# EAGLE design embedded-gw (EAGLE 9.6.2)
AUTHOR: Neal Jackson; REV: A; TITLE: Embedded GW

## Sheet 1 of 3
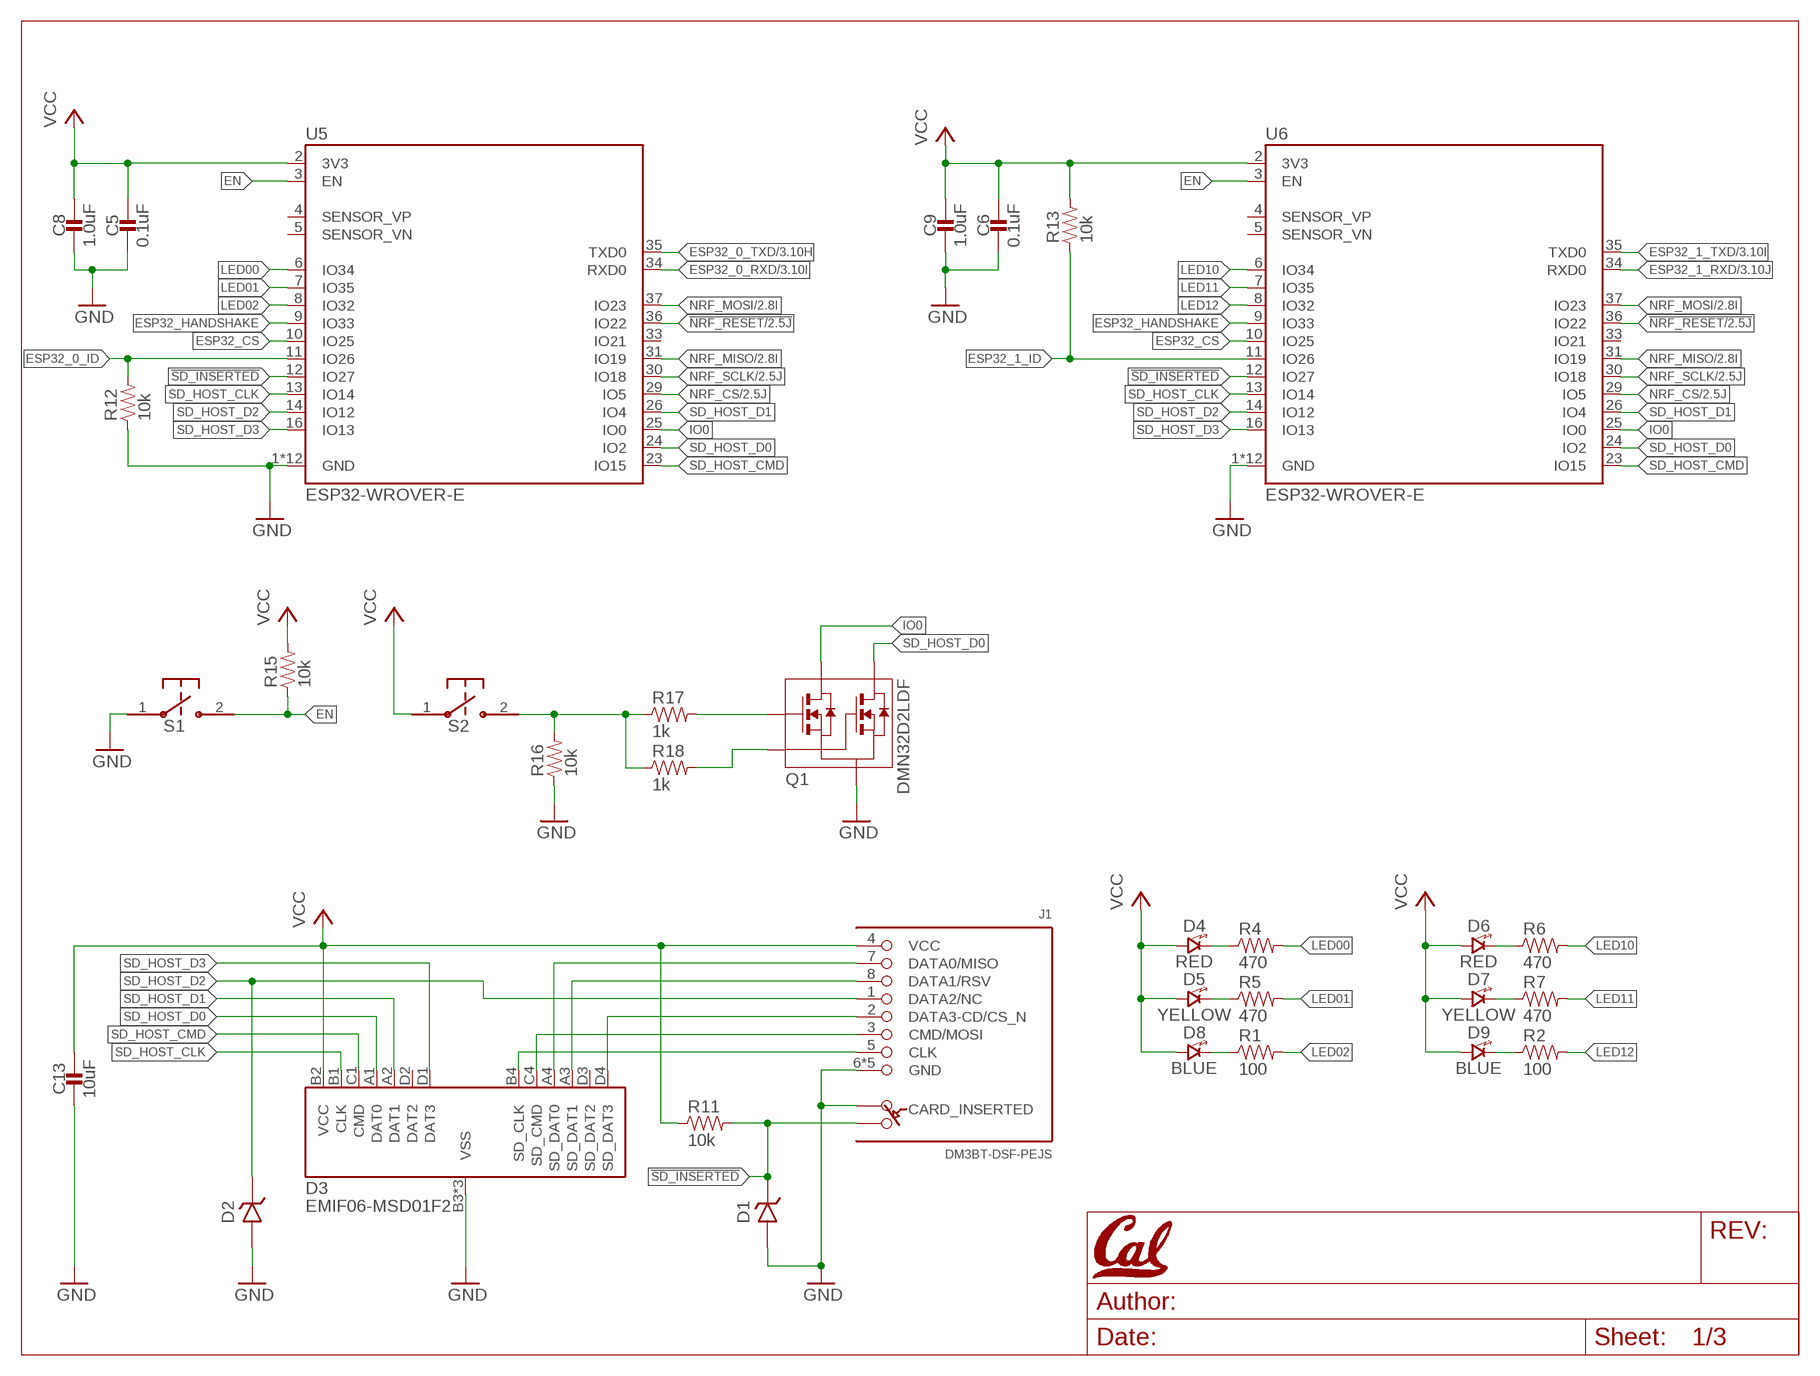
[diagram p0: schematic, sheet 1]
U$1 (LETTER_L_CAL): HEIGHT: 8.5in; WIDTH: 11in

### Parts
C5  0.1uF  CAPACITOR0402_CAP  [0402_CAP]
C6  0.1uF  CAPACITOR0402_CAP  [0402_CAP]
C8  1.0uF  CAPACITOR0402_CAP  [0402_CAP]
C9  1.0uF  CAPACITOR0402_CAP  [0402_CAP]
C13  10uF  CAPACITOR0805_CAP  [0805_CAP]
D1  DIODE_ZENER0201  [0201_DIODE]
D2  DIODE_ZENER0201  [0201_DIODE]
D3  EMIF06-MSD01F2  [BGA16C50P4X4_192X192X65N]
D4  RED  LED0603  [LED-0603]
D5  YELLOW  LED0603  [LED-0603]
D6  RED  LED0603  [LED-0603]
D7  YELLOW  LED0603  [LED-0603]
D8  BLUE  LED0603  [LED-0603]
D9  BLUE  LED0603  [LED-0603]
J1  DM3BT-DSF-PEJS  [HRS_DM3BT-DSF-PEJS]
Q1  DMN32D2LDF  [SOT353]
R1  100  RESISTOR0402_RES  [0402_RES]
R2  100  RESISTOR0402_RES  [0402_RES]
R4  470  RESISTOR0402_RES  [0402_RES]
R5  470  RESISTOR0402_RES  [0402_RES]
R6  470  RESISTOR0402_RES  [0402_RES]
R7  470  RESISTOR0402_RES  [0402_RES]
R11  10k  RESISTOR0402_RES  [0402_RES]
R12  10k  RESISTOR0402_RES  [0402_RES]
R13  10k  RESISTOR0402_RES  [0402_RES]
R15  10k  RESISTOR0402_RES  [0402_RES]
R16  10k  RESISTOR0402_RES  [0402_RES]
R17  1k  RESISTOR0402_RES  [0402_RES]
R18  1k  RESISTOR0402_RES  [0402_RES]
S1  B3U-1000P  [B3U-1000P]
S2  B3U-1000P  [B3U-1000P]
U5  ESP32-WROVER-E  [ESP32-WROVER-E]
U6  ESP32-WROVER-E  [ESP32-WROVER-E]

### Nets
!NRF_RESET: U5.36(IO22) U6.36(IO22) ; also sheet 2
!SD_INSERTED: D1.P$1(CATHODE) J1.SW-B(B) R11.2 U5.12(IO27) U6.12(IO27)
EN: R15.1 S1.2 U5.3(EN) U6.3(EN)
ESP32_0_ID: R12.2 U5.11(IO26)
ESP32_0_RXD: U5.34(RXD0) ; also sheet 3
ESP32_0_TXD: U5.35(TXD0) ; also sheet 3
ESP32_1_ID: R13.1 U6.11(IO26)
ESP32_1_RXD: U6.34(RXD0) ; also sheet 3
ESP32_1_TXD: U6.35(TXD0) ; also sheet 3
ESP32_CS: U5.10(IO25) U6.10(IO25)
ESP32_HANDSHAKE: U5.9(IO33) U6.9(IO33)
GND: C5.2 C6.2 C8.2 C9.2 C13.P$2 D1.P$2(ANODE) D2.P$2(ANODE) D3.B3(VSS) D3.C2(VSS) D3.C3(VSS) J1.6(GND) J1.S1(GND) J1.S2(GND) J1.S3(GND) J1.S4(GND) J1.SW-A(A) Q1.S R12.1 R16.1 S1.1 U5.1(GND) U5.15(GND) U5.38(GND) U5.GND1(GND) U5.GND2(GND) U5.GND3(GND) U5.GND4(GND) U5.GND5(GND) U5.GND6(GND) U5.GND7(GND) U5.GND8(GND) U5.GND9(GND) U6.1(GND) U6.15(GND) U6.38(GND) U6.GND1(GND) U6.GND2(GND) U6.GND3(GND) U6.GND4(GND) U6.GND5(GND) U6.GND6(GND) U6.GND7(GND) U6.GND8(GND) U6.GND9(GND) ; also sheet 2,3
IO0: Q1.D1 U5.25(IO0) U6.25(IO0)
LED00: R4.2 U5.6(IO34)
LED01: R5.2 U5.7(IO35)
LED02: R1.2 U5.8(IO32)
LED10: R6.2 U6.6(IO34)
LED11: R7.2 U6.7(IO35)
LED12: R2.2 U6.8(IO32)
N$1: Q1.G1 R17.2
N$4: Q1.G2 R18.2
N$5: R16.2 R17.1 R18.1 S2.2
N$6: D3.C4(SD_CMD) J1.3(CMD/MOSI)
N$8: D3.A4(SD_DAT0) J1.7(DATA0/MISO)
N$9: D3.A3(SD_DAT1) J1.8(DATA1/RSV)
N$11: D3.D4(SD_DAT3) J1.2(DATA3-CD/CS_N)
N$12: D4.C(CATHODE) R4.1
N$13: D3.B4(SD_CLK) J1.5(CLK)
N$14: D5.C(CATHODE) R5.1
N$15: D8.C(CATHODE) R1.1
N$19: D6.C(CATHODE) R6.1
N$20: D7.C(CATHODE) R7.1
N$21: D9.C(CATHODE) R2.1
NRF_CS: U5.29(IO5) U6.29(IO5) ; also sheet 2
NRF_MISO: U5.31(IO19) U6.31(IO19) ; also sheet 2
NRF_MOSI: U5.37(IO23) U6.37(IO23) ; also sheet 2
NRF_SCLK: U5.30(IO18) U6.30(IO18) ; also sheet 2
SD_HOST_CLK: D3.B1(CLK) U5.13(IO14) U6.13(IO14)
SD_HOST_CMD: D3.C1(CMD) U5.23(IO15) U6.23(IO15)
SD_HOST_D0: D3.A1(DAT0) Q1.D2 U5.24(IO2) U6.24(IO2)
SD_HOST_D1: D3.A2(DAT1) U5.26(IO4) U6.26(IO4)
SD_HOST_D2: D2.P$1(CATHODE) J1.1(DATA2/NC) U5.14(IO12) U6.14(IO12)
SD_HOST_D3: D3.D1(DAT3) U5.16(IO13) U6.16(IO13)
VCC: C5.1 C6.1 C8.1 C9.1 C13.P$1 D3.B2(VCC) D4.A(ANODE) D5.A(ANODE) D6.A(ANODE) D7.A(ANODE) D8.A(ANODE) D9.A(ANODE) J1.4(VCC) R11.1 R13.2 R15.2 S2.1 U5.2(3V3) U6.2(3V3) ; also sheet 2,3
Unconnected: D3.D2(DAT2) D3.D3(SD_DAT2) U5.4(SENSOR_VP) U5.5(SENSOR_VN) U5.33(IO21) U6.4(SENSOR_VP) U6.5(SENSOR_VN) U6.33(IO21)

## Sheet 2 of 3
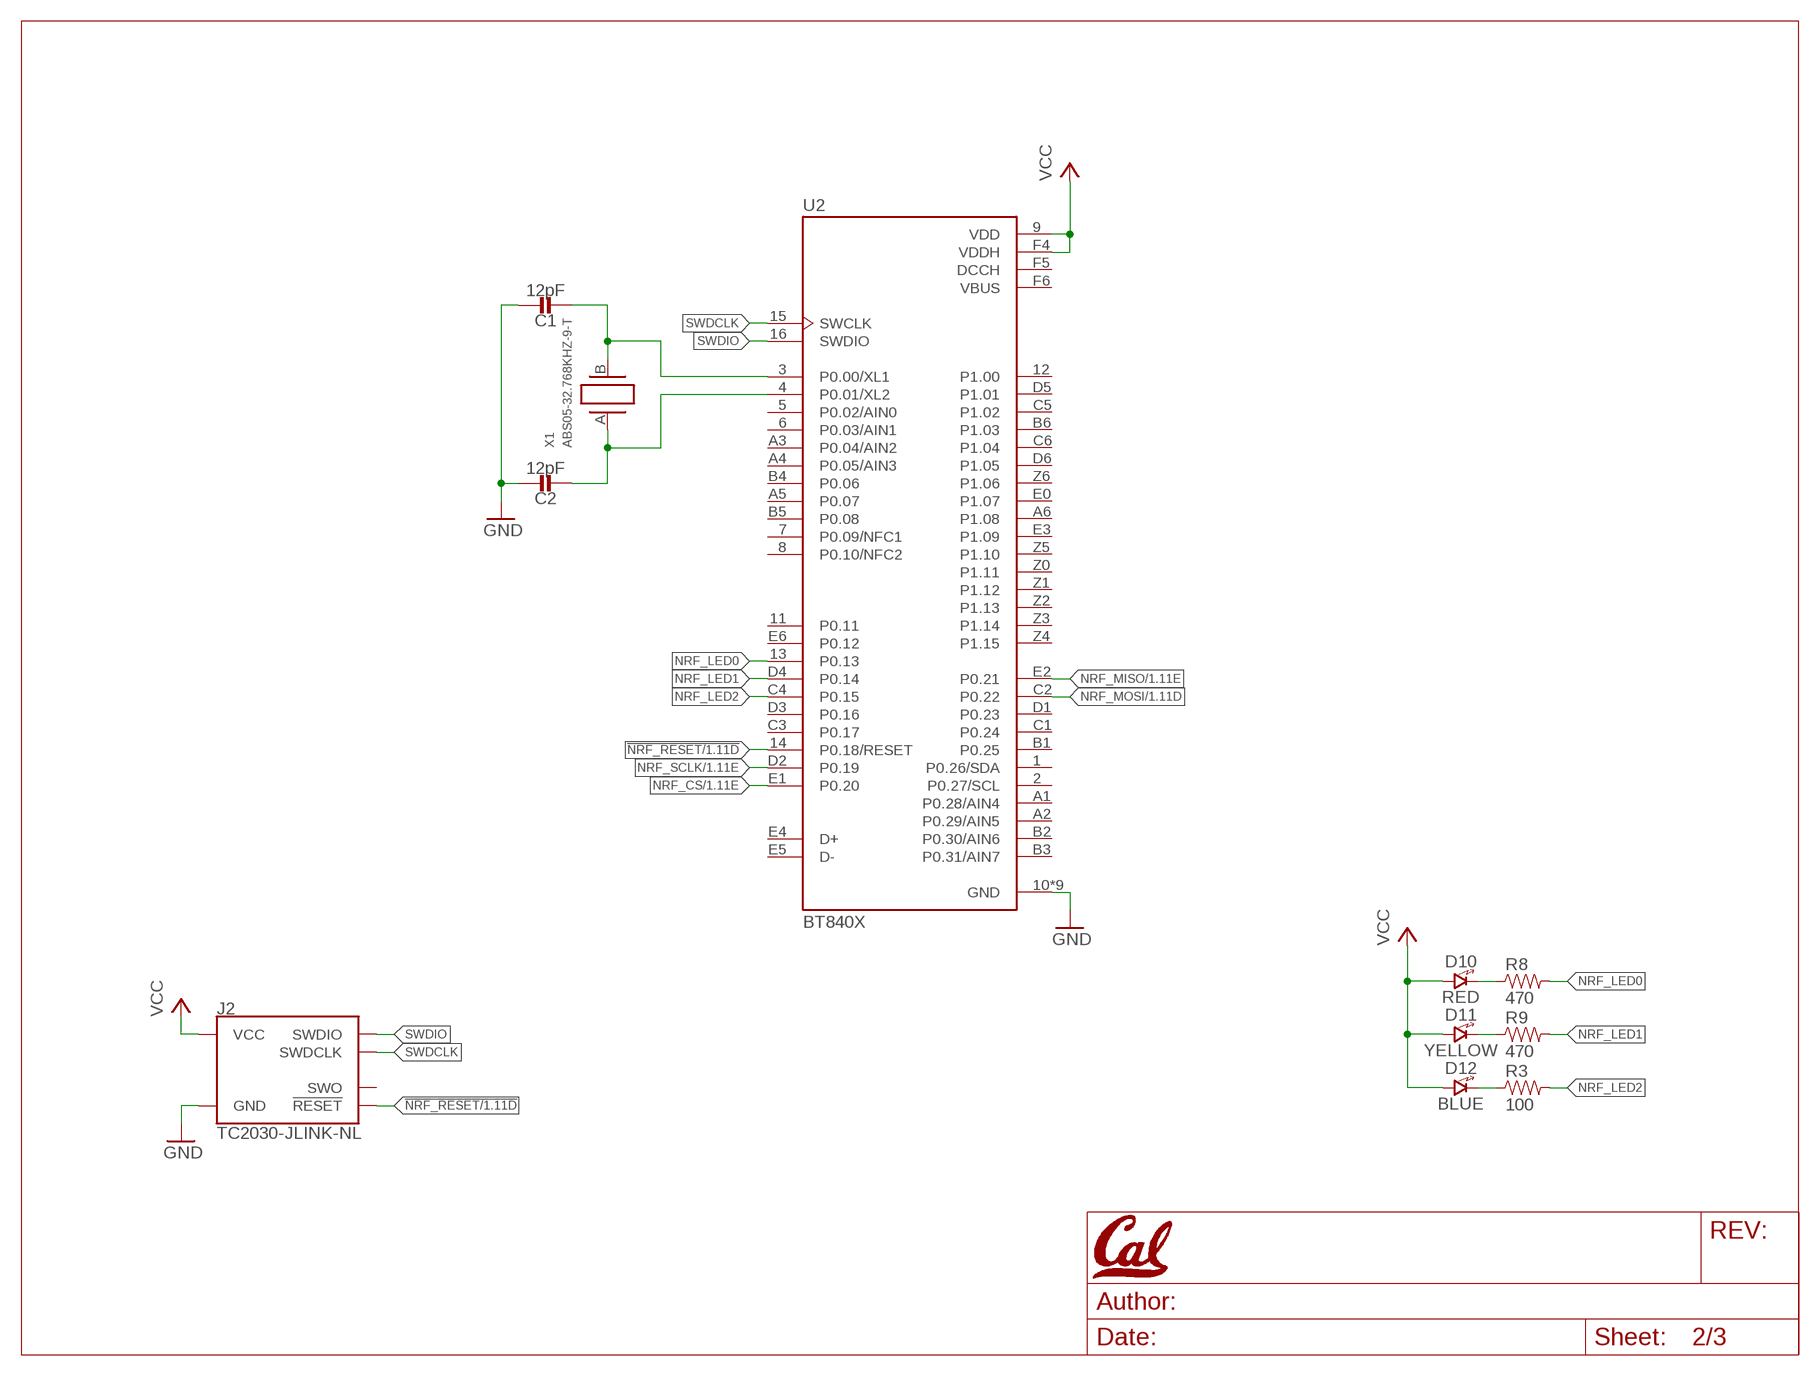
[diagram p1: schematic, sheet 2]
U$2 (LETTER_L_CAL): HEIGHT: 8.5in; WIDTH: 11in

### Parts
C1  12pF  CAPACITOR0402_CAP  [0402_CAP]
C2  12pF  CAPACITOR0402_CAP  [0402_CAP]
D10  RED  LED0603  [LED-0603]
D11  YELLOW  LED0603  [LED-0603]
D12  BLUE  LED0603  [LED-0603]
J2  TC2030-JLINK-NL  [TC2030-IDC-NL]
R3  100  RESISTOR0402_RES  [0402_RES]
R8  470  RESISTOR0402_RES  [0402_RES]
R9  470  RESISTOR0402_RES  [0402_RES]
U2  BT840X  [XCVR_BT840X]
X1  ABS05-32.768KHZ-9-T  [ABS05]

### Nets
!NRF_RESET: J2.3(!RESET) U2.14(P0.18/RESET) ; also sheet 1
GND: C1.1 C2.1 J2.5(GND) U2.10(GND) U2.A0(GND) U2.B0(GND) U2.C0(GND) U2.D0(GND) U2.F0(GND) U2.F1(GND) U2.F2(GND) U2.F3(GND) ; also sheet 1,3
N$2: C1.2 U2.3(P0.00/XL1) X1.B
N$3: C2.2 U2.4(P0.01/XL2) X1.A
N$22: D10.C(CATHODE) R8.1
N$23: D11.C(CATHODE) R9.1
N$24: D12.C(CATHODE) R3.1
NC: U2.F6(VBUS)
NRF_CS: U2.E1(P0.20) ; also sheet 1
NRF_LED0: R8.2 U2.13(P0.13)
NRF_LED1: R9.2 U2.D4(P0.14)
NRF_LED2: R3.2 U2.C4(P0.15)
NRF_MISO: U2.E2(P0.21) ; also sheet 1
NRF_MOSI: U2.C2(P0.22) ; also sheet 1
NRF_SCLK: U2.D2(P0.19) ; also sheet 1
SWDCLK: J2.4(SWDCLK) U2.15(SWCLK)
SWDIO: J2.2(SWDIO) U2.16(SWDIO)
VCC: D10.A(ANODE) D11.A(ANODE) D12.A(ANODE) J2.1(VCC) U2.9(VDD) U2.F4(VDDH) ; also sheet 1,3
Unconnected: J2.6(SWO) U2.1(P0.26/SDA) U2.2(P0.27/SCL) U2.5(P0.02/AIN0) U2.6(P0.03/AIN1) U2.7(P0.09/NFC1) U2.8(P0.10/NFC2) U2.11(P0.11) U2.12(P1.00) U2.A1(P0.28/AIN4) U2.A2(P0.29/AIN5) U2.A3(P0.04/AIN2) U2.A4(P0.05/AIN3) U2.A5(P0.07) U2.A6(P1.08) U2.B1(P0.25) U2.B2(P0.30/AIN6) U2.B3(P0.31/AIN7) U2.B4(P0.06) U2.B5(P0.08) U2.B6(P1.03) U2.C1(P0.24) U2.C3(P0.17) U2.C5(P1.02) U2.C6(P1.04) U2.D1(P0.23) U2.D3(P0.16) U2.D5(P1.01) U2.D6(P1.05) U2.E0(P1.07) U2.E3(P1.09) U2.E4(D+) U2.E5(D-) U2.E6(P0.12) U2.Z0(P1.11) U2.Z1(P1.12) U2.Z2(P1.13) U2.Z3(P1.14) U2.Z4(P1.15) U2.Z5(P1.10) U2.Z6(P1.06)

## Sheet 3 of 3
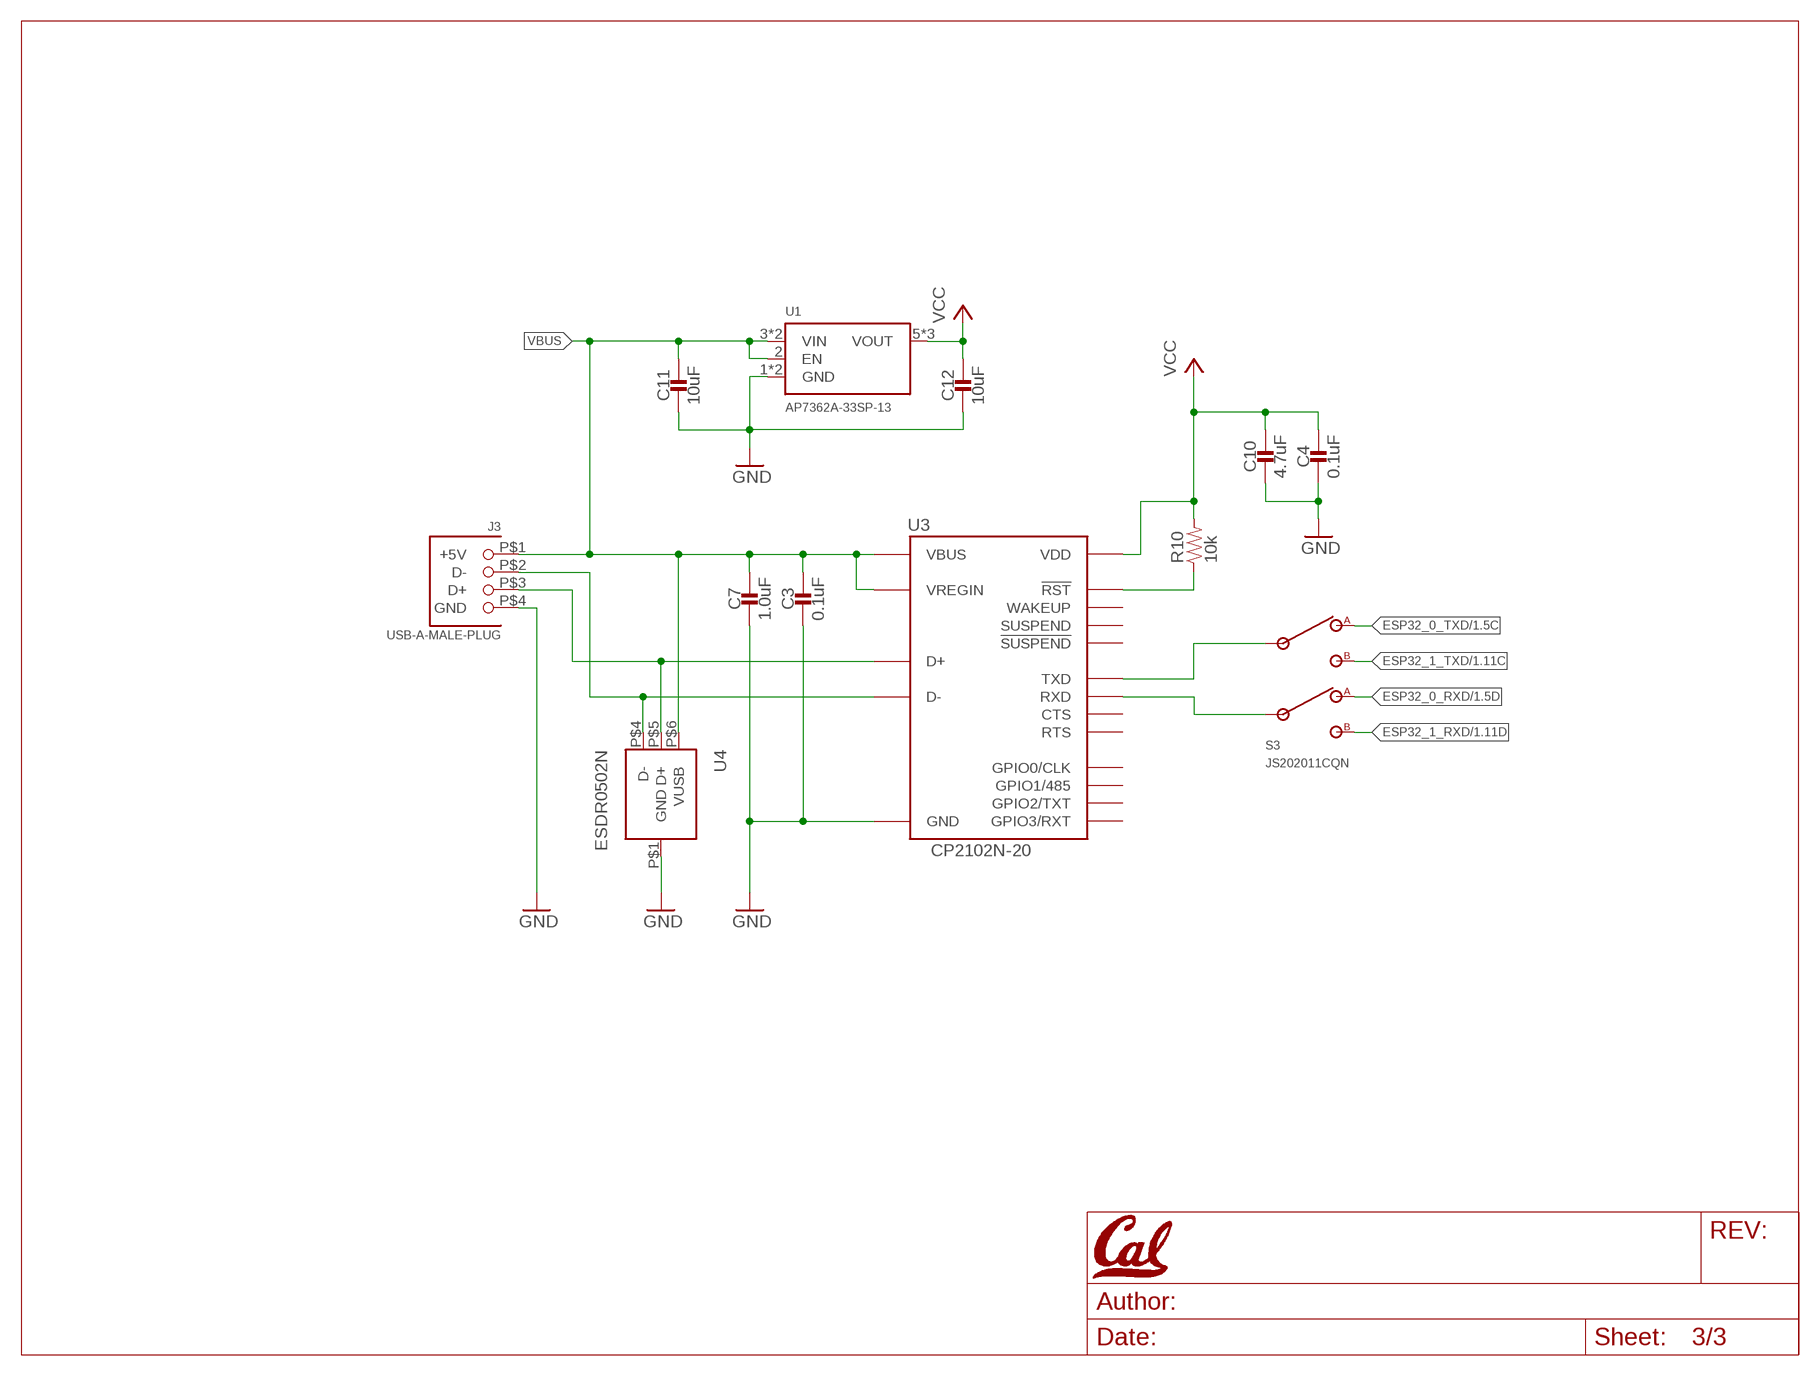
[diagram p2: schematic, sheet 3]
U$3 (LETTER_L_CAL): HEIGHT: 8.5in; WIDTH: 11in

### Parts
C3  0.1uF  CAPACITOR0402_CAP  [0402_CAP]
C4  0.1uF  CAPACITOR0402_CAP  [0402_CAP]
C7  1.0uF  CAPACITOR0402_CAP  [0402_CAP]
C10  4.7uF  CAPACITOR0603_CAP  [0603_CAP]
C11  10uF  CAPACITOR0805_CAP  [0805_CAP]
C12  10uF  CAPACITOR0805_CAP  [0805_CAP]
J3  USB-A-MALE-PLUG  [USB_A_MALE_PLUG_CUI_UP2-AH]
R10  10k  RESISTOR0402_RES  [0402_RES]
S3  JS202011CQN  [JS202011CQN]
U1  AP7362A-33SP-13  [SO-8EP]
U3  CP2102N-20  [QFN-20-3MM]
U4  ESDR0502N  [UDFN-6]

### Nets
D+: J3.P$3(D+) U3.4(D+) U4.P$5(D+)
D-: J3.P$2(D-) U3.5(D-) U4.P$4(D-)
ESP32_0_RXD: S3.1(A2) ; also sheet 1
ESP32_0_TXD: S3.4(A1) ; also sheet 1
ESP32_1_RXD: S3.3(B2) ; also sheet 1
ESP32_1_TXD: S3.6(B1) ; also sheet 1
GND: C3.2 C4.2 C7.2 C10.2 C11.P$2 C12.P$2 J3.P$4(GND) U1.1(GND) U1.PAD(GND) U3.3(GND) U3.12(GND) U3.P$1(GND) U4.P$1(GND) ; also sheet 1,2
N$7: R10.1 U3.9(!RST)
RXD: S3.2(I2) U3.17(RXD)
TXD: S3.5(I1) U3.18(TXD)
VBUS: C3.1 C7.1 C11.P$1 J3.P$1(+5V) U1.2(EN) U1.3(VIN) U1.4(VIN) U3.7(VREGIN) U3.8(VBUS) U4.P$6(VUSB)
VCC: C4.1 C10.1 C12.P$1 R10.2 U1.5(VOUT) U1.6(VOUT) U1.7(VOUT) U3.6(VDD) ; also sheet 1,2
Unconnected: U3.1(GPIO1/485) U3.2(GPIO0/CLK) U3.11(!SUSPEND) U3.13(WAKEUP) U3.14(SUSPEND) U3.15(CTS) U3.16(RTS) U3.19(GPIO3/RXT) U3.20(GPIO2/TXT)

## Power pins joined to a net without a drawn wire
DCCH: U2.F5(DCCH)

## Library data of the parts
C1 C2 = passives:CAPACITOR: SMD Capacitor; DIGIKEY: 490-GCM1555C1H120GA16DCT-ND; MPN: GCM1555C1H120GA16D
C3-C6 = passives:CAPACITOR: SMD Capacitor; DIGIKEY: 1276-1511-1-ND; MPN: CL05B104KQ5NNNC
C7-C9 = passives:CAPACITOR: SMD Capacitor; DIGIKEY: 1276-1010-1-ND; MPN: CL05A105KQ5NNNC
C10 = passives:CAPACITOR: SMD Capacitor; DIGIKEY: 1276-1045-1-ND; MPN: CL10A475KQ8NNNC
C11-C13 = passives:CAPACITOR: SMD Capacitor; DIGIKEY: 1276-2404-1-ND; MPN: CL21A106KQCLNNC
D1 D2 = passives:DIODE_ZENER; DIGIKEY: ESD7381MUT5GOSCT-ND; MPN: ESD7381MUT5G
D3 = passives:EMIF06-MSD01F2: Mini and micro SD Card - EMI filtering and 25 kV ESD protection; DIGIKEY: 497-5903-1-ND; MANUFACTURER: STMicroelectronics; MPN: EMIF06-MSD01F2
D4 D6 D10 = leds:LED: LED; DIGIKEY: 160-1830-1-ND; MPN: LTST-C193KRKT-5A
D5 D7 D11 = leds:LED: LED; DIGIKEY: 160-1831-1-ND; MPN: LTST-C193KSKT-5A
D8 D9 D12 = leds:LED: LED; DIGIKEY: 160-1827-1-ND; MPN: LTST-C193TBKT-5A
J1 = connector:DM3BT-DSF-PEJS: 10 (8 + 2) Position Card Connector Secure Digital - microSD™ Surface Mount, Right Angle Gold Check prices <https://pricing.snapeda.com/parts/DM3BT-DSF-PEJS/Hirose%20Connector/view-part?ref=eda>; DIGIKEY: HR1942TR-ND; MANUFACTURER: Hirose Connector; MPN: DM3BT-DSF-PEJS
J2 = connector:TC2030-JLINK
J3 = connector:USB-A-MALE-PLUG: USB A Male plug connector; DIGIKEY: 102-3996-ND; MANUFACTURER: CUI; MPN: UP2-AH-1-TH
Q1 = fets:DMN32D2LDF: Common source dual n-channel mosfet; DIGIKEY: DMN32D2LDF-7DICT-ND; MANUFACTURER: Diodes Incorporated; MPN: DMN32D2LDF-7
R1-R3 = passives:RESISTOR: Resistor Basic schematic elements and footprints for 0201, 0402, 0603, 1206, and PTH resistors.; DIGIKEY: 311-100JRCT-ND; MPN: RC0402JR-07100RL
R4-R9 = passives:RESISTOR: Resistor Basic schematic elements and footprints for 0201, 0402, 0603, 1206, and PTH resistors.; DIGIKEY: 311-470LRCT-ND; MPN: RC0402FR-07470RL
R10-R13 R15 R16 = passives:RESISTOR: Resistor Basic schematic elements and footprints for 0201, 0402, 0603, 1206, and PTH resistors.; DIGIKEY: RMCF0402JT10K0CT-ND; MPN: RMCF0402JT10K0
R17 R18 = passives:RESISTOR: Resistor Basic schematic elements and footprints for 0201, 0402, 0603, 1206, and PTH resistors.; DIGIKEY: RMCF0402JT1K00CT-ND; MPN: RMCF0402JT1K00
S1 S2 = switches:B3U: Switch; DIGIKEY: SW1020CT-ND; MANUFACTURER: Omron; MPN: B3U-1000P
S3 = switches:JS202011CQN: DPDT through hole; DIGIKEY: 401-2001-ND; MANUFACTURER: C&K; MPN: JS202011CQN
U1 = chips:AP7362: The AP7362 is a 1.5A adjustable/fixed output voltage linear regulator with ultra-low dropout; DIGIKEY: AP7362A-33SP-13DICT-ND; MANUFACTURER: Diodes Incorporated; MPN: AP7362A-33SP-13
U2 = BT840X:BT840X: 802.15.4, Bluetooth Bluetooth v5.0, Thread, Zigbee® Transceiver Module 2.4GHz PCB Trace Surface Mou Check prices <https://pricing.snapeda.com/parts/BT840X/Fanstel%20Corp./view-part?ref=eda>; DIGIKEY: 1914-BT840XCT-ND; MANUFACTURER: Fanstel Corp.; MPN: BT840X
U3 = chips:CP2102N-20: A cheap, simple USB to UART adapter; DIGIKEY: 336-3692-ND; MANUFACTURER: SiLabs; MPN: CP2102N-A01-GQFN20
U4 = chips:ESDR0502N; DIGIKEY: ESDR0502NMUTBGOSCT-ND; MPN: ESDR0502NMUTBG
U5 U6 = chips:ESP32-WROVER-E; DIGIKEY: 1965-ESP32-WROVER-E(8MB)CT-ND; MANUFACTURER: Espressif Systems; MPN: ESP32-WROVER-E (8MB)
X1 = crystals:ABS05-32.768KHZ: 32.768kHz Crystal; DIGIKEY: 535-11897-1-ND; MANUFACTURER: Abracon; MPN: ABS05-32.768KHZ-9-T

## Board
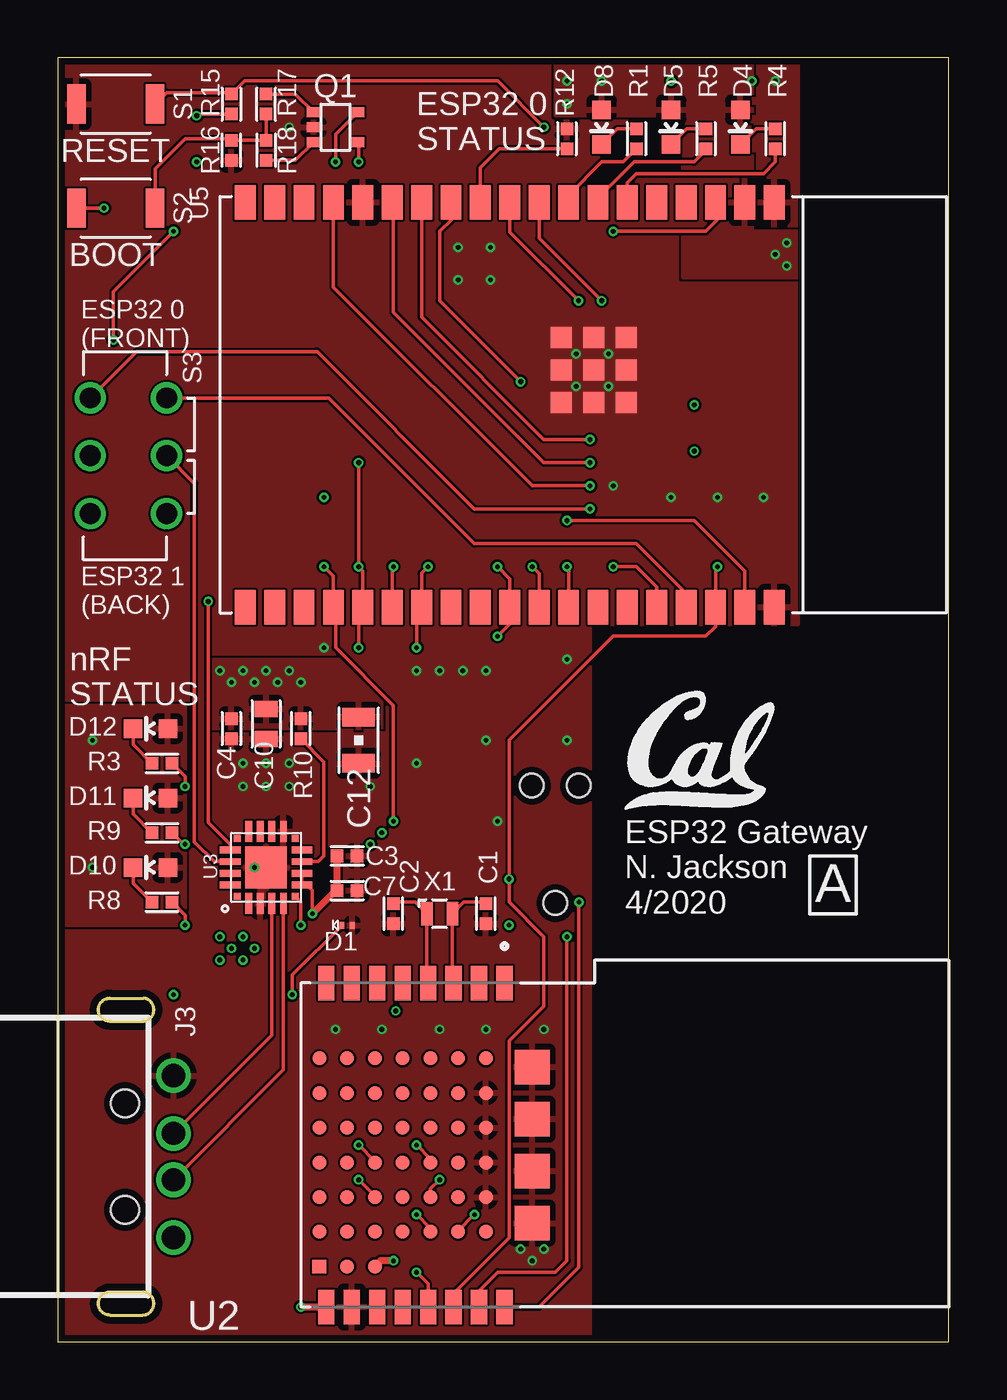
[diagram p3: board, top side]
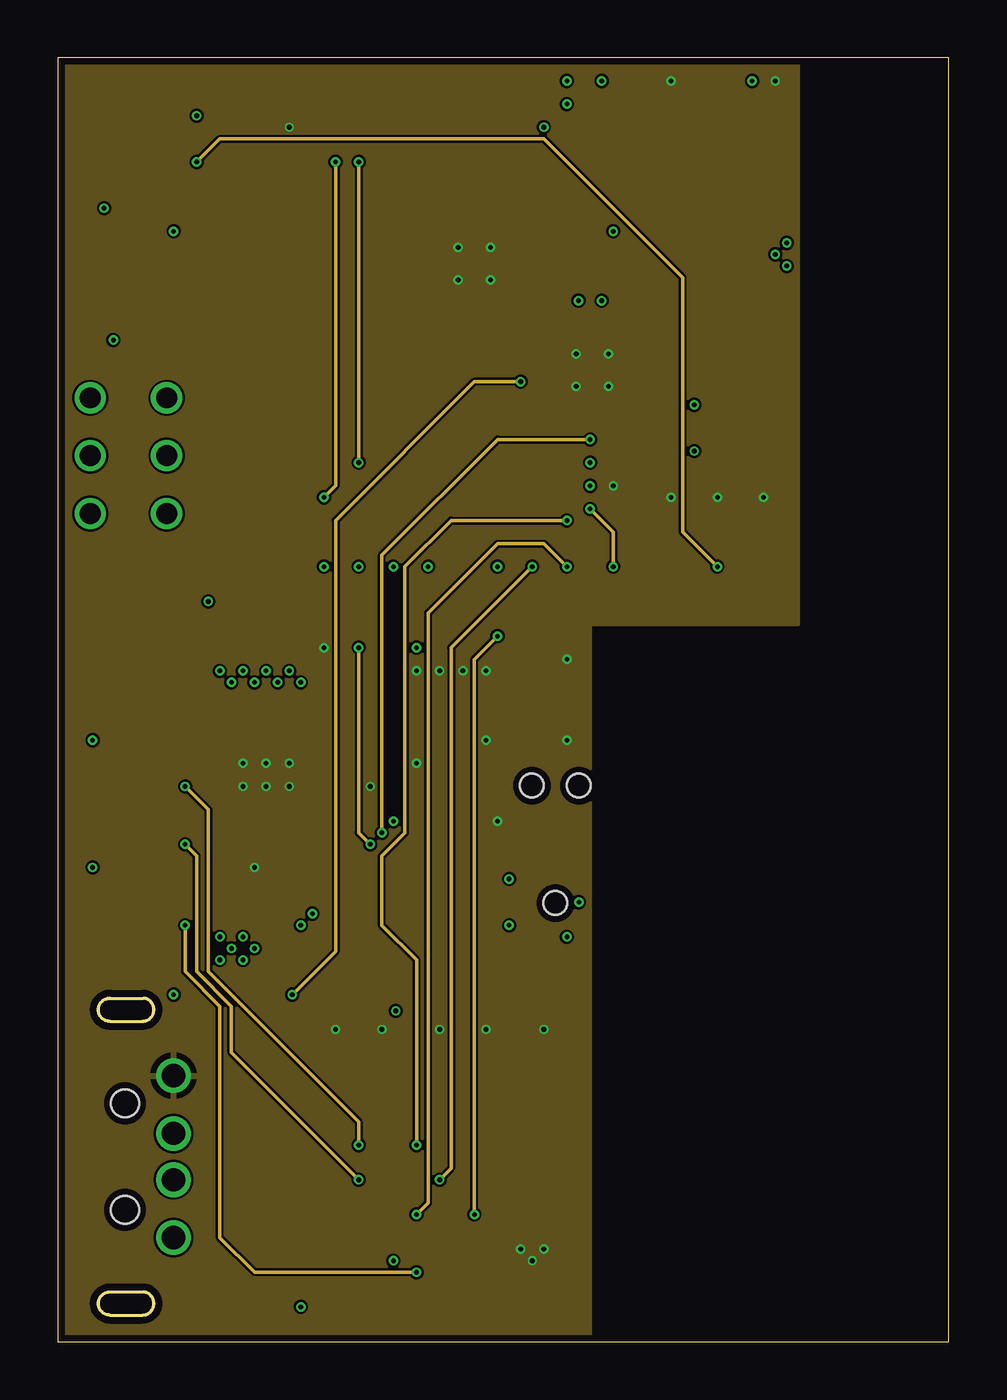
[diagram p4: board, inner layer Route2]
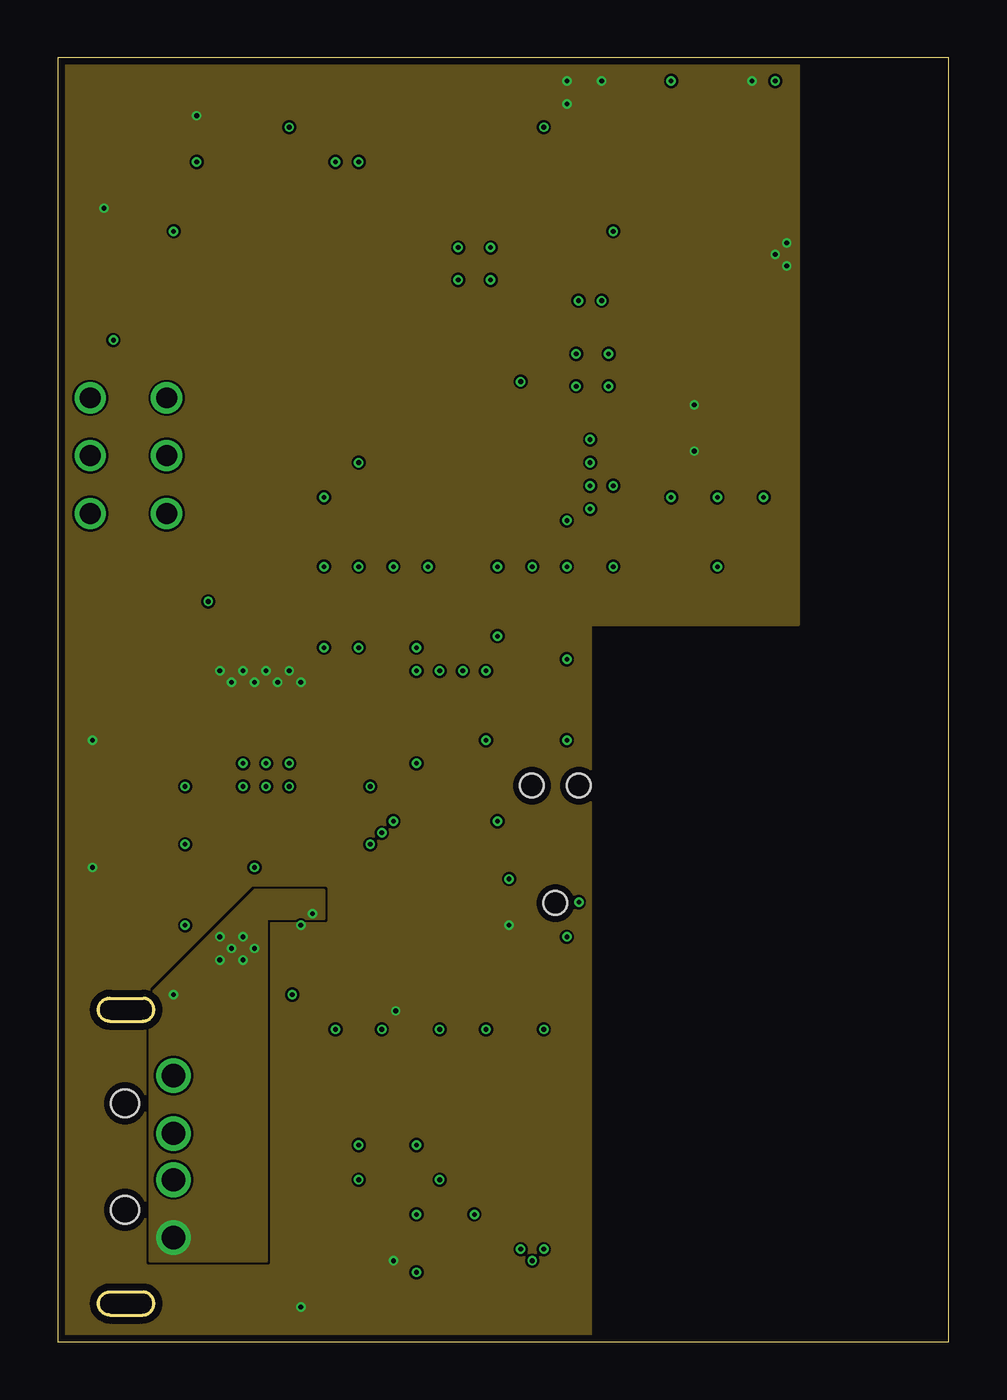
[diagram p5: board, inner layer Route15]
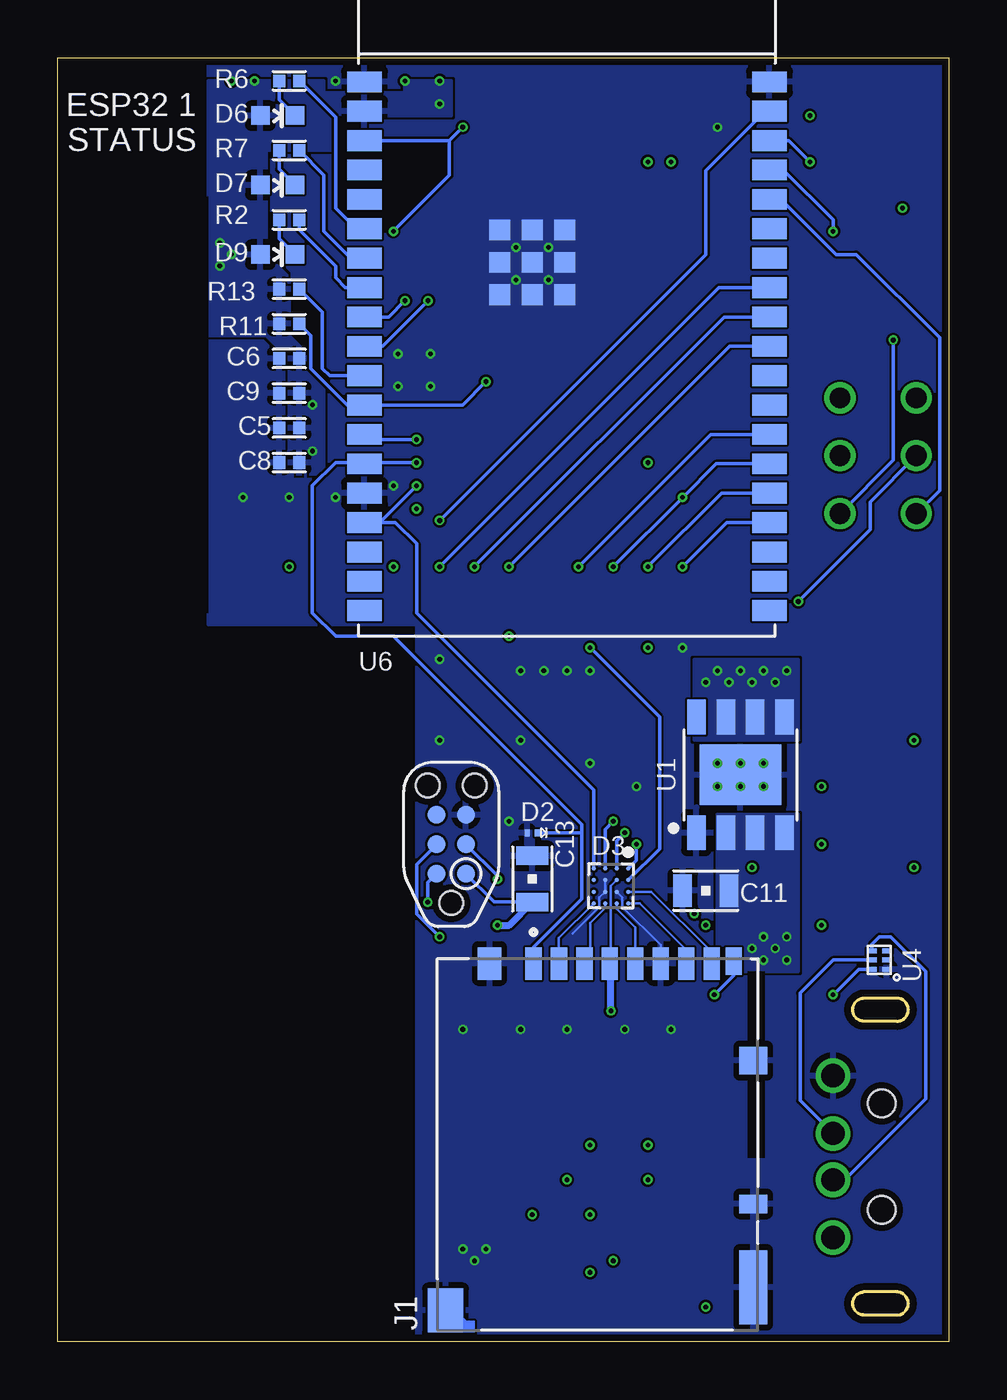
[diagram p6: board, bottom side, seen from below]

Size 38.5 x 55.5 mm. Coordinates in mm from the lower left corner, seen from the top.
Outline: 0,0 38.5,0 38.5,55.5 0,55.5 0,0
Copper layers (1+2*15+16): Top 0.0178mm / dielectric 59mil / Route2 0.0356mm / dielectric 0.1499mm / Route15 0.0356mm / dielectric 0.2007mm / Bottom 0.0178mm
Design rules "quickturn_co_kr_1oz_4lyr *": minimum track width 4mil, minimum drill 8mil, track to track 4mil, track to pad 4mil, pad to pad 4mil, via to via 4mil, smd to smd 4mil, copper to edge 12mil, drill to drill 12mil, minimum pad ring 8mil, minimum via ring 4mil, stop-mask expansion 3mil, vias tented up to drill 50mil, thermal gap 10mil

### Footprints (pad centres in the part's own frame; a part is rotated, then mirrored left to right if it is on the bottom)
0402_CAP = smd 0.536 x 0.546: 1 -0.433,0; 2 0.433,0
0603_CAP = smd 0.7 x 1: 1 -0.65,0; 2 0.65,0
0805_CAP = smd 0.8 x 1.4: P$1 1,0; P$2 -1,0
0201_DIODE = smd 0.3 x 0.21: P$1 0,0.22; P$2 0,-0.22
BGA16C50P4X4_192X192X65N = smd 0.2 x 0.2: A1 -0.75,0.75; A2 -0.25,0.75; A3 0.25,0.75; A4 0.75,0.75; B1 -0.75,0.25; B2 -0.25,0.25; B3 0.25,0.25; B4 0.75,0.25; C1 -0.75,-0.25; C2 -0.25,-0.25; C3 0.25,-0.25; C4 0.75,-0.25; D1 -0.75,-0.75; D2 -0.25,-0.75; D3 0.25,-0.75; D4 0.75,-0.75
LED-0603 = smd 0.8 x 0.8: A 0,-0.75; C 0,0.75
HRS_DM3BT-DSF-PEJS = smd 0.7 x 1.4: 1 -2.775,0.7; 2 -1.675,0.7; 3 -0.575,0.7; 4 0.525,0.7; 5 1.625,0.7; 6 2.725,0.7; 7 3.825,0.7; 8 4.925,0.7 | smd 1 x 1.4: S1 -4.675,0.7 | smd 1.2 x 1.2: S2 6.725,-3.5 | smd 1.2 x 3.2: S3 6.725,-13.3 | smd 1.5 x 1.9: S4 -6.575,-14.3 | smd 1.2 x 0.8: SW-A 6.725,-9.7 | smd 0.7 x 1.2: SW-B 5.875,0.8
TC2030-IDC-NL = smd 0.787 x 0.787: 1 -1.27,-0.635; 2 -1.27,0.635; 3 0,-0.635; 4 0,0.635; 5 1.27,-0.635; 6 1.27,0.635 | hole 1.016: -2.54,0; 2.54,1.016; 2.54,-1.016
USB_A_MALE_PLUG_CUI_UP2-AH = drill 1: P$1 3.5,5; P$2 1,5; P$3 -1,5; P$4 -3.5,5 | hole 1.2: -2.3,2.9; 2.3,2.9
SOT353 = smd 0.42 x 0.6: D1 0.65,-0.95; D2 -0.65,-0.95; G1 0.65,0.95; G2 -0.65,0.95; S 0,0.95
0402_RES = smd 0.536 x 0.546: 1 -0.433,0; 2 0.433,0
B3U-1000P = smd 0.8 x 1.7: 1 -1.7,0; 2 1.7,0
JS202011CQN = drill 0.9: 1 0,0; 2 2.5,0; 3 5,0; 4 0,3.3; 5 2.5,3.3; 6 5,3.3
SO-8EP = smd 1.505 x 0.802: 1 -2.5,1.905; 2 -2.5,0.635; 3 -2.5,-0.635; 4 -2.5,-1.905; 5 2.5,0.635; 6 2.5,-0.635; 7 2.5,-1.905; 8 2.5,1.905 | smd 2.613 x 3.502: PAD 0,0
XCVR_BT840X = smd 1.5 x 0.7: 1 -7,-5.2; 2 -7,-6.3; 3 -7,-7.4; 4 -7,-8.5; 5 -7,-9.6; 6 -7,-10.7; 7 -7,-11.8; 8 -7,-12.9; 9 7,-12.9; 10 7,-11.8; 11 7,-10.7; 12 7,-9.6; 13 7,-8.5; 14 7,-7.4; 15 7,-6.3; 16 7,-5.2 | smd 0.6 x 0.6: A0 -2.25,-6; A1 -2.25,-7.2; A2 -2.25,-8.4; A3 -2.25,-9.6; A4 -2.25,-10.8; A5 -2.25,-12; A6 -2.25,-13.2; B0 -0.75,-6; B1 -0.75,-7.2; B2 -0.75,-8.4; B3 -0.75,-9.6; B4 -0.75,-10.8; B5 -0.75,-12; B6 -0.75,-13.2; C0 0.75,-6; C1 0.75,-7.2; C2 0.75,-8.4; C3 0.75,-9.6; C4 0.75,-10.8; C5 0.75,-12; C6 0.75,-13.2; D0 2.25,-6; D1 2.25,-7.2; D2 2.25,-8.4; D3 2.25,-9.6; D4 2.25,-10.8; D5 2.25,-12; D6 2.25,-13.2; E0 3.75,-6; E1 3.75,-7.2; E2 3.75,-8.4; E3 3.75,-9.6; E4 3.75,-10.8; E5 3.75,-12; E6 3.75,-13.2; F4 5.25,-10.8; F5 5.25,-12; F6 5.25,-13.2; Z0 -3.75,-6; Z1 -3.75,-7.2; Z2 -3.75,-8.4; Z3 -3.75,-9.6; Z4 -3.75,-10.8; Z5 -3.75,-12; Z6 -3.75,-13.2 | smd 1.5 x 1.5: F0 -3.375,-4; F1 -1.125,-4; F2 1.125,-4; F3 3.375,-4
QFN-20-3MM = smd 0.3 x 0.3: 1 -1.25,1.25; 6 -1.25,-1.25; 11 1.25,-1.25; 16 1.25,1.25 | smd 0.9 x 0.3: 2 -1.55,0.75; 3 -1.55,0.25; 4 -1.55,-0.25; 5 -1.55,-0.75; 12 1.55,-0.75; 13 1.55,-0.25; 14 1.55,0.25; 15 1.55,0.75 | smd 0.3 x 0.9: 7 -0.75,-1.55; 8 -0.25,-1.55; 9 0.25,-1.55; 10 0.75,-1.55; 17 0.75,1.55; 18 0.25,1.55; 19 -0.25,1.55; 20 -0.75,1.55 | smd 1.8 x 1.8: P$1 0,0
UDFN-6 = smd 0.42 x 0.22: P$1 -0.325,0.4; P$2 -0.325,0; P$3 -0.325,-0.4; P$4 0.325,-0.4; P$5 0.325,0; P$6 0.325,0.4
ESP32-WROVER-E = smd 1.5 x 0.9: 1 0.25,23.96; 2 0.25,22.69; 3 0.25,21.42; 4 0.25,20.15; 5 0.25,18.88; 6 0.25,17.61; 7 0.25,16.34; 8 0.25,15.07; 9 0.25,13.8; 10 0.25,12.53; 11 0.25,11.26; 12 0.25,9.99; 13 0.25,8.72; 14 0.25,7.45; 15 0.25,6.18; 16 0.25,4.91; 17 0.25,3.64; 18 0.25,2.37; 19 0.25,1.1; 20 17.75,1.1; 21 17.75,2.37; 22 17.75,3.64; 23 17.75,4.91; 24 17.75,6.18; 25 17.75,7.45; 26 17.75,8.72; 27 17.75,9.99; 28 17.75,11.26; 29 17.75,12.53; 30 17.75,13.8; 31 17.75,15.07; 32 17.75,16.34; 33 17.75,17.61; 34 17.75,18.88; 35 17.75,20.15; 36 17.75,21.42; 37 17.75,22.69; 38 17.75,23.96 | smd 0.9 x 0.9: GND1 6.1,17.56; GND2 7.5,17.56; GND3 8.9,17.56; GND4 6.1,16.16; GND5 7.5,16.16; GND6 8.9,16.16; GND7 6.1,14.76; GND8 7.5,14.76; GND9 8.9,14.76
ABS05 = smd 0.5 x 1: A -0.55,0; B 0.55,0

### Placement (x,y rotation side)
C1  18.5,18.5 90 top
C2  14.5,18.5 90 top
C3  12.5,21 0 top
C4  7.5,26.5 270 top
C5  28.5,39.5 180 bottom
C6  28.5,42.5 180 bottom
C7  12.5,19.5 0 top
C8  28.5,38 180 bottom
C9  28.5,41 180 bottom
C10  9,26.7 270 top
C11  10.5,19.5 0 bottom
C12  13,26 90 top
C13  18,20 270 bottom
D1  12.5,18 90 top
D2  18,22 270 bottom
D3  14.6,19.7 270 bottom
D4  29.5,52.5 180 top
D5  26.5,52.5 180 top
D6  29,53 270 bottom
D7  29,50 270 bottom
D8  23.5,52.5 180 top
D9  29,47 270 bottom
D10  4,20.5 90 top
D11  4,23.5 90 top
D12  4,26.5 90 top
J1  15.17,15.65 0 bottom
J2  21.5,21.5 90 bottom
J3  0,8 270 top
Q1  12,52.5 90 top
R1  25,52 270 top
R2  28.5,48.5 0 bottom
R3  4.5,25 0 top
R4  31,52 270 top
R5  28,52 270 top
R6  28.5,54.5 0 bottom
R7  28.5,51.5 0 bottom
R8  4.5,19 0 top
R9  4.5,22 0 top
R10  10.5,26.5 90 top
R11  28.5,44 0 bottom
R12  22,52 270 top
R13  28.5,45.5 180 bottom
R15  7.5,53.5 270 top
R16  7.5,51.5 90 top
R17  9,53.5 90 top
R18  9,51.5 270 top
S1  2.5,53.5 0 top
S2  2.5,49 0 top
S3  1.4,40.8 270 top
U1  9,24.5 90 bottom
U2  24.5,8.5 270 top
U3  9,20.5 90 top
U4  3,16.5 180 bottom
U5  7,49.5 270 top
U6  25.5,30.5 0 bottom
U$4  [UCB_CAL_200MIL]  24.5,23 0 top
X1  16.5,18.5 0 top

### Tracks (layer width: path | path; a pad name or v marks a point on that pad's centre or on a via)
!NRF_RESET  (via drill 0.2)
  Top 0.152: v28.5,33.5 28.42,33.42 U5.36 28.42,30.92 28,30.5 24,30.5 19.5,26 v19.5,20 19.5,19 21,17.5 21,14.5 19.5,13 19.5,4.5 17.1,2.1 U2.14
  Route2 0.152: v6,51 7,52 21,52 27,46 27,35 v28.5,33.5
  Bottom 0.152: v19.5,20 19.5,20.14 J2.3 | U6.36 6.92,51.92 v6,51
!SD_INSERTED  (via drill 0.2)
  Top 0.152: U5.12 16.99,48.49 16.5,48 16.5,45 v20,41.5 | v10.13,15 10.13,15.85 D1.P$1
  Route2 0.152: v20,41.5 18,41.5 12,35.5 12,16.87 v10.13,15
  Bottom 0.152: J1.SW-B 9.29,15.84 v10.13,15 | v20,41.5 21.01,40.49 U6.12 25.99,40.49 27.57,42.07 27.57,43.5 R11.2
D+
  Top 0.152: U3.4 9.25,13.25 J3.P$3
  Bottom 0.152: U4.P$5 5,16.5 6.43,15.07 6.43,10.43 J3.P$3
D-
  Top 0.152: U3.5 9.75,11.75 J3.P$2
  Bottom 0.152: U4.P$4 3.33,17.18 3,17.5 2.5,17.5 1,16 1,10.5 4.5,7 J3.P$2
EN  (via drill 0.2)
  Top 0.102: 28.5,48.5 28.5,49.17 U5.3
  Top 0.152: S1.2 4.7,54 7.43,54 R15.1 8.07,54.5 19,54.5 v21,52.5 | v24,48 28,48 28.5,48.5
  Bottom 0.152: v21,52.5 21.58,51.92 | 21.58,51.92 U6.3 | v24,48 21.58,50.42 21.58,51.92
ESP32_0_ID
  Top 0.152: U5.11 18.26,50.76 19.07,51.57 R12.2
ESP32_0_RXD  (via drill 0.2)
  Top 0.152: v24,33.5 25,33.5 25.88,32.62 U5.34 | v23,36 18,36 11.2,42.8 3.4,42.8 S3.1
  Route2 0.152: v23,36 24,35 v24,33.5
ESP32_0_TXD
  Top 0.152: U5.35 27.15,32.35 25,34.5 18,34.5 11.7,40.8 S3.4
ESP32_1_ID
  Bottom 0.152: U6.11 26.76,41.76 27.07,42.07 27.07,44.5 R13.1
ESP32_1_RXD
  Bottom 0.152: U6.34 7.25,49.38 4.87,47 4,47 0.4,43.4 0.4,36.8 S3.3
ESP32_1_TXD  (via drill 0.2)
  Top 0.152: v5,48 2.4,45.4 v2.4,43.3
  Bottom 0.152: U6.35 7.15,50.65 5,48.5 v5,48 | v2.4,43.3 2.4,38.1 S3.6
ESP32_CS  (via drill 0.2)
  Top 0.152: U5.10 19.53,47.97 v22.5,45
  Bottom 0.152: U6.10 24.47,43.03 v22.5,45
ESP32_HANDSHAKE  (via drill 0.2)
  Top 0.152: U5.9 20.8,47.7 v23.5,45
  Bottom 0.152: v23.5,45 24.2,44.3 U6.9
GND  (via drill 0.2)
  Bottom 0.102: J1.6 12.45,17.14 14.1,18.8 14.1,19.2 D3.B3 | D3.C2 D3.C3 15.1,19.2 15.1,18.8 16.25,17.65
  other vias: 8,25 9,25 10,25 8,24 9,24 10,24 8.5,20.5 20,4 21,4 20.5,3.5 21,13.5 18.5,13.5 11.5,30 17.3,47.3 18.7,47.3 17.3,45.9 18.7,45.9 22.4,42.7 23.8,42.7 22.4,41.3 23.8,41.3 13.5,24 31,54.5 26.5,54.5 14,13.5 19,22.5 22,26 15.5,25 26.5,36.5 24,37 28.5,36.5 30.5,36.5 22,29.5 18.5,26 18.5,29 17.5,29 16.5,29 15.5,29 12,13.5 10,52.5 16.5,13.5
  pour Top (rank 2): 0,55.5 32,55.5 32,31 23,31 23,0 0,0
  pour Bottom (rank 2): 0,55.5 32,55.5 32,31 23,31 23,0 0,0
  pour Route2: 0,55.5 32,55.5 32,31 23,31 23,0 0,0
  pour Bottom (no thermals): 15.5,49 15.5,44 20.5,44 20.5,49
  pour Top (no thermals): 20.5,44.5 25.5,44.5 25.5,39.5 20.5,39.5
IO0  (via drill 0.2)
  Top 0.152: U5.25 14.45,33.45 v14.5,33.5 | Q1.D1 12,52.2 v12,51
  Route2 0.152: v12,51 12,37 v11.5,36.5
  Bottom 0.152: U6.25 10.05,37.95 v11.5,36.5 v14.5,33.5
LED00
  Top 0.152: U5.6 24.61,50.11 25,50.5 30.5,50.5 31,51 R4.2
LED01
  Top 0.152: R5.2 28,51.5 27.5,51 24.91,51 23.34,49.43 U5.7
LED02
  Top 0.152: U5.8 22.07,49.57 23.5,51 24.43,51 R1.2
LED10
  Bottom 0.152: U6.6 25.61,48.11 26.5,49 26.5,52.93 R6.2
LED11
  Bottom 0.152: R7.2 27,50.43 27,48 25.84,46.84 U6.7
LED12
  Bottom 0.152: R2.2 28.07,48.07 26.5,46.5 26.5,46 26.07,45.57 U6.8
N$1
  Top 0.152: R17.2 10.27,53.93 Q1.G1
N$2
  Top 0.152: U2.3 17.05,15.55 X1.B 17.55,19 18.43,19 C1.2
N$3
  Top 0.152: C2.2 14.57,19 15.45,19 X1.A 15.95,15.55 U2.4
N$4
  Top 0.152: R18.2 10.27,51.07 Q1.G2
N$5
  Top 0.152: S2.2 4.2,50.7 5.5,52 7.43,52 R16.2 R18.1 R17.1
N$6
  Bottom 0.102: J1.3 15.5,16.59 15.5,18.1 14.85,18.75 D3.C4
N$7
  Top 0.152: U3.9 11.25,20.75 11.5,21 11.5,25.07 R10.1
N$8
  Bottom 0.102: D3.A4 13.35,18.95 11.35,16.95 J1.7
N$9
  Bottom 0.102: D3.A3 12.85,19.45 10.24,16.84 J1.8
N$11
  Bottom 0.102: J1.2 16.84,17.45 D3.D4
N$12
  Top 0.152: D4.C 30.18,52.43 R4.1
N$13
  Bottom 0.102: J1.5 13.54,17.9 14.35,18.7 D3.B4
N$14
  Top 0.152: D5.C 27.18,52.43 R5.1
N$15
  Top 0.152: D8.C 24.18,52.43 R1.1
N$19
  Bottom 0.152: R6.1 28.93,53.68 D6.C
N$20
  Bottom 0.152: R7.1 28.93,50.68 D7.C
N$21
  Bottom 0.152: D9.C 28.93,47.68 R2.1
N$22
  Top 0.152: R8.1 3.25,19.82 D10.C
N$23
  Top 0.152: R9.1 3.25,22.82 D11.C
N$24
  Top 0.152: R3.1 3.25,25.82 D12.C
NRF_CS  (via drill 0.2)
  Top 0.152: U2.E1 17.3,4.8 v18,5.5 | v19,33.5 19.53,32.97 U5.29 19.53,31.03 v19,30.5
  Route2 0.152: v19,30.5 18,29.5 v18,5.5
  Bottom 0.152: U6.29 9.47,43.03 v19,33.5
NRF_LED0  (via drill 0.2)
  Top 0.152: R8.2 5.5,18.43 v5.5,18 | U2.13 16,2.5 v15.5,3
  Route2 0.152: v15.5,3 8.5,3 7,4.5 7,14.5 5.5,16 v5.5,18
NRF_LED1  (via drill 0.2)
  Top 0.152: v13,7 13.7,6.3 U2.D4 | R9.2 5.43,21.5 v5.5,21.5
  Route2 0.152: v13,7 7.5,12.5 7.5,14.5 6,16 6,21 v5.5,21.5
NRF_LED2  (via drill 0.2)
  Top 0.152: v13,8.5 13.7,7.8 U2.C4 | R3.2 5.5,24.43 v5.5,24
  Route2 0.152: v5.5,24 6.5,23 6.5,16 13,9.5 v13,8.5
NRF_MISO  (via drill 0.2)
  Top 0.152: v15.5,5.5 16.1,4.9 U2.E2 | v22,33.5 22.07,33.43 U5.31
  Route2 0.152: v15.5,5.5 16,6 16,31.5 19,34.5 21,34.5 v22,33.5
  Bottom 0.152: U6.31 9.93,45.57 v22,33.5
NRF_MOSI  (via drill 0.2)
  Top 0.152: v15.5,8.5 16.1,7.9 U2.C2 | v22,35.5 27.5,35.5 29.69,33.31 U5.37
  Route2 0.152: v15.5,8.5 15.5,16.5 14,18 14,21 15,22 15,33.5 17,35.5 v22,35.5
  Bottom 0.152: U6.37 7.93,53.19 10.5,50.62 10.5,47 v22,35.5
NRF_SCLK  (via drill 0.2)
  Top 0.152: v16.5,7 16.1,6.6 U2.D2 | v20.5,33.5 20.8,33.2 U5.30
  Route2 0.152: v16.5,7 17,7.5 17,30 v20.5,33.5
  Bottom 0.152: U6.30 9.7,44.3 v20.5,33.5
RXD  (via drill 0.2)
  Top 0.152: U3.17 7.45,21.5 6.5,22.45 v6.5,32
  Bottom 0.152: S3.2 3.4,36.3 3.4,35.1 v6.5,32
SD_HOST_CLK  (via drill 0.2)
  Top 0.152: v23,39 21,39 15.72,44.28 U5.13
  Route2 0.152: v14,22 14,34 19,39 v23,39
  Bottom 0.152: D3.B1 14.35,21.65 v14,22 | U6.13 25.03,39 v23,39
SD_HOST_CMD  (via drill 0.2)
  Top 0.152: v11.5,33.5 11.91,33.09 U5.23 12,31.66 12,30 14.5,27.5 v14.5,22.5
  Bottom 0.152: D3.C1 14.85,22.15 v14.5,22.5 | U6.23 9.59,35.41 v11.5,33.5
SD_HOST_D0  (via drill 0.2)
  Top 0.152: v13,30 13,31.57 U5.24 13.18,33.32 v13,33.5 v13,38 | Q1.D2 13,51.8 v13,51
  Route2 0.152: v13.5,21.5 13,22 v13,30 | v13,51 v13,38
  Bottom 0.152: v13.5,21.5 13.5,20.8 D3.A1 | U6.24 9.82,36.68 v13,33.5
SD_HOST_D1  (via drill 0.2)
  Top 0.152: v16,33.5 15.72,33.22 U5.26 15.5,31.53 v15.5,30
  Bottom 0.152: U6.26 10.28,39.22 v16,33.5 | D3.A2 12.5,21.3 12.5,27 v15.5,30
SD_HOST_D2  (via drill 0.2)
  Top 0.152: U5.14 14.5,49.2 14.5,44.5 21,38 v23,38
  Bottom 0.152: v23,38 25.2,38 U6.14 25.3,38 26.5,38 27.5,37 27.5,31.5 26.5,30.5 24,30.5 15.85,22.35 15.85,22 | 15.85,22 15.85,19.15 17.95,17.05 J1.1 | D2.P$1 15.85,22
SD_HOST_D3  (via drill 0.2)
  Top 0.152: U5.16 11.91,45.59 20.5,37 v23,37
  Bottom 0.152: v23,37 24.59,35.41 U6.16 23.91,35.41 23,34.5 23,31.5 15.35,23.85 D3.D1
SWDCLK  (via drill 0.2)
  Top 0.152: U2.15 18.2,2.2 19,3 21.5,3 22,3.5 v22,17.5
  Bottom 0.152: v22,17.5 23,18.5 23,20.64 J2.4
SWDIO  (via drill 0.2)
  Top 0.152: U2.16 20.8,1.5 22.52,3.22 v22.52,19
  Bottom 0.152: v22.52,19 22.52,19.85 J2.2
TXD
  Top 0.152: U3.18 6.75,20.75 5.9,21.6 5.9,37.1 S3.5
VBUS  (via drill 0.2)
  Top 0.152: U3.8 U3.7 10.75,19.75 11,19.5 v11,18.5
  Top 0.305: C3.1 C7.1 12,19.5 v11,18.5
  Bottom 0.152: U4.P$6 3.9,16.1 v5,15
  other vias: 7,17.5 7,16.5 7.5,17 8,17.5 8.5,17 8,16.5
  pour Bottom (no thermals): 6.5,22.8 6.5,16 10,16 10,22.8
  pour Route15 (no thermals): 9,3.5 4,3.5 4,15 8.5,19.5 11.5,19.5 11.5,18.3 9,18.3
VCC  (via drill 0.2)
  Top 0.152: U3.6 10.5,19 v10.5,18 | R15.2 6.07,53.07 v6,53 | S2.1 v2,49
  Top 0.305: v10.5,1.5 U2.9 | v14.5,3.5 13.95,3.5 U2.F4
  Bottom 0.102: D3.B2 14.6,19.7 14.6,16.39 J1.4
  Bottom 0.152: C13.P$1 19.64,19 J2.1
  Bottom 0.305: v19.5,18 19,18 C13.P$1 | v14.6,14.3 14.6,16.3 J1.4
  other vias: 7.5,28.5 8.5,28.5 8,29 9,29 30,54.5 23.5,54.5 31,47 31.5,47.5 31.5,46.5 1.5,26 1.5,20.5 22,54.5 22,53.5 27.5,40.5 27.5,38.5 9.5,28.5 10,29 10.5,28.5 7,29
  pour Route15 (rank 2): 0,55.5 32,55.5 32,31 23,31 23,0 0,0
  pour Bottom (no thermals): 11,29.5 6.5,29.5 6.5,26 11,26
  pour Top: 30,55.5 21.5,55.5 21.5,53 27,53 27,46 32,46 32,48 30,48
  pour Bottom: 32,54.5 27,54.5 27,54 23.5,54 23.5,54.5 21.5,54.5 21.5,53 24.5,53 24.5,51.5 29.5,51.5 29.5,47 28.5,46 28.5,43.5 27,42 27,37.5 28.5,37.5 28.5,42.5 29.5,43.5 32,43.5
  pour Top: 0,27.5 5.5,27.5 5.5,18 0,18
  pour Top: 6.5,29.5 6.5,26.5 14,26.5 14,29.5

### Text on the board
tPlace: ESP32 0 / STATUS | ESP32 0 / (FRONT) | ESP32 1 / (BACK) | nRF / STATUS | ESP32 Gateway / N. Jackson / 4/2020
bPlace: ESP32 1 / STATUS
tNames: RESET | BOOT